# EAGLE schematic moistureSensor (EAGLE 7.4.0)
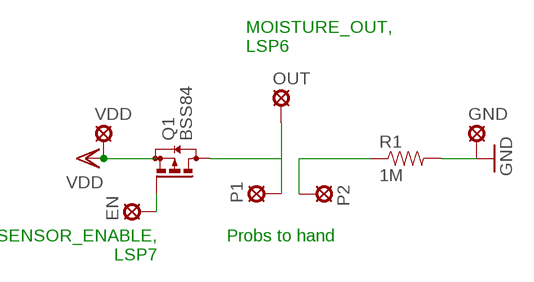
[diagram p0: schematic, sheet 1]

## Parts
EN  MCS10B  [MCS10B]
GND  MCS10B  [MCS10B]
OUT  MCS10B  [MCS10B]
P1  MCS10B  [MCS10B]
P2  MCS10B  [MCS10B]
Q1  BSS84  [SOT23]
R1  1M  1MOHM-1/10W-1%(0603)  [0603-RES]
VDD  MCS10B  [MCS10B]

## Nets
GND: GND.MP R1.2
N$1: P2.MP R1.1
N$2: EN.MP Q1.1(G)
N$3: OUT.MP P1.MP Q1.3(D)
VDD: Q1.2(S) VDD.MP

## Notes on the sheet
- MOISTURE_OUT,
  LSP6
- SENSOR_ENABLE,
  LSP7
- Probs to hand

## Library data of the parts
EN GND OUT P1 P2 VDD = solpad:MCS10B: SOLDER PAD MC S1, distributor Buerklin, 15F505
Q1 = transistor-small-signal:BSS84: P-CHANNEL MOS FET
R1 = SparkFun-Resistors:1MOHM-1/10W-1%(0603): RES-07868; PROD_ID: RES-07868